# Altium schematic sheet Sheet1.SchDoc
size A4
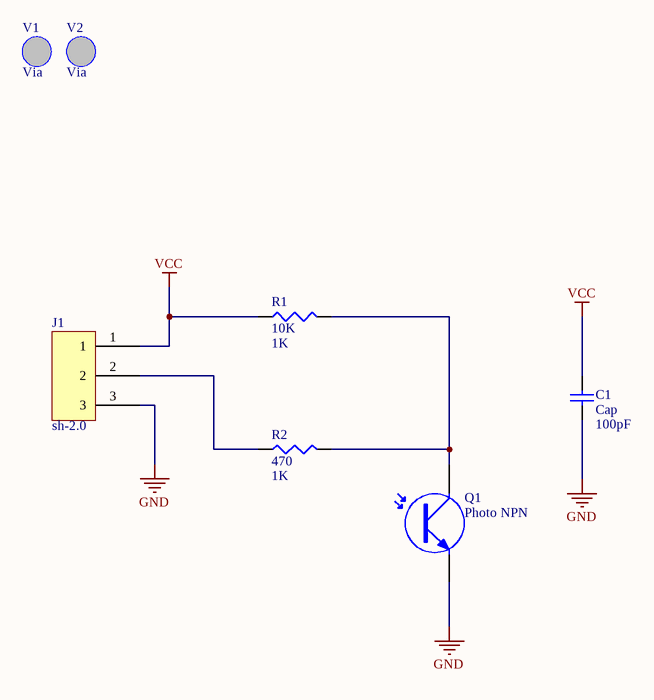
[diagram p0: Sheet1.SchDoc]

## Parts
C1  Cap  value 100pF  [1608[0603]]
J1  sh-2.0  [sh-2.0]
Q1  Photo NPN  [Q]
R1  10K  value 1K  [1608[0603]]
R2  470  value 1K  [1608[0603]]
V1  Via  [Via]
V2  Via  [Via]

## Nets
GND: C1.1 J1.3 Q1.3(E)
VCC: C1.2 J1.1 R1.1
NetJ1_2: J1.2 R2.1
NetQ1_1: Q1.1(C) R1.2 R2.2

## Library data of the parts
C1 = Cap: Capacitor; Published: 8-Jun-2000; LatestRevisionDate: 17-Jul-2002; LatestRevisionNote: Re-released for DXP Platform.; PackageReference: RAD-0.3; Publisher: Altium Limited; PackageDescription: Radial Cap, Thru-Hole; 2 Leads; 0.3 in Pin Spacing
J1 = sh-2.0: pin to pad: 1>2 2>1
Q1 = Photo NPN: NPN Phototransistor; Published: 24-Mar-1999; LatestRevisionDate: 17-Jul-2002; LatestRevisionNote: Re-released for DXP Platform.; PackageReference: TO-220_A; Publisher: Altium Limited; Code_JEDEC: TO-220-AC
R1 R2 = Res3: Resistor; Published: 8-Jun-2000; LatestRevisionDate: 29-May-2009; LatestRevisionNote: IPC-7351 Footprint Added.; PackageReference: J1-0603; Publisher: Altium Limited; PackageDescription: Chip Resistor